# Altium schematic sheet Schematic.SchDoc
size A; SheetNumber: 1; SheetTotal: 1
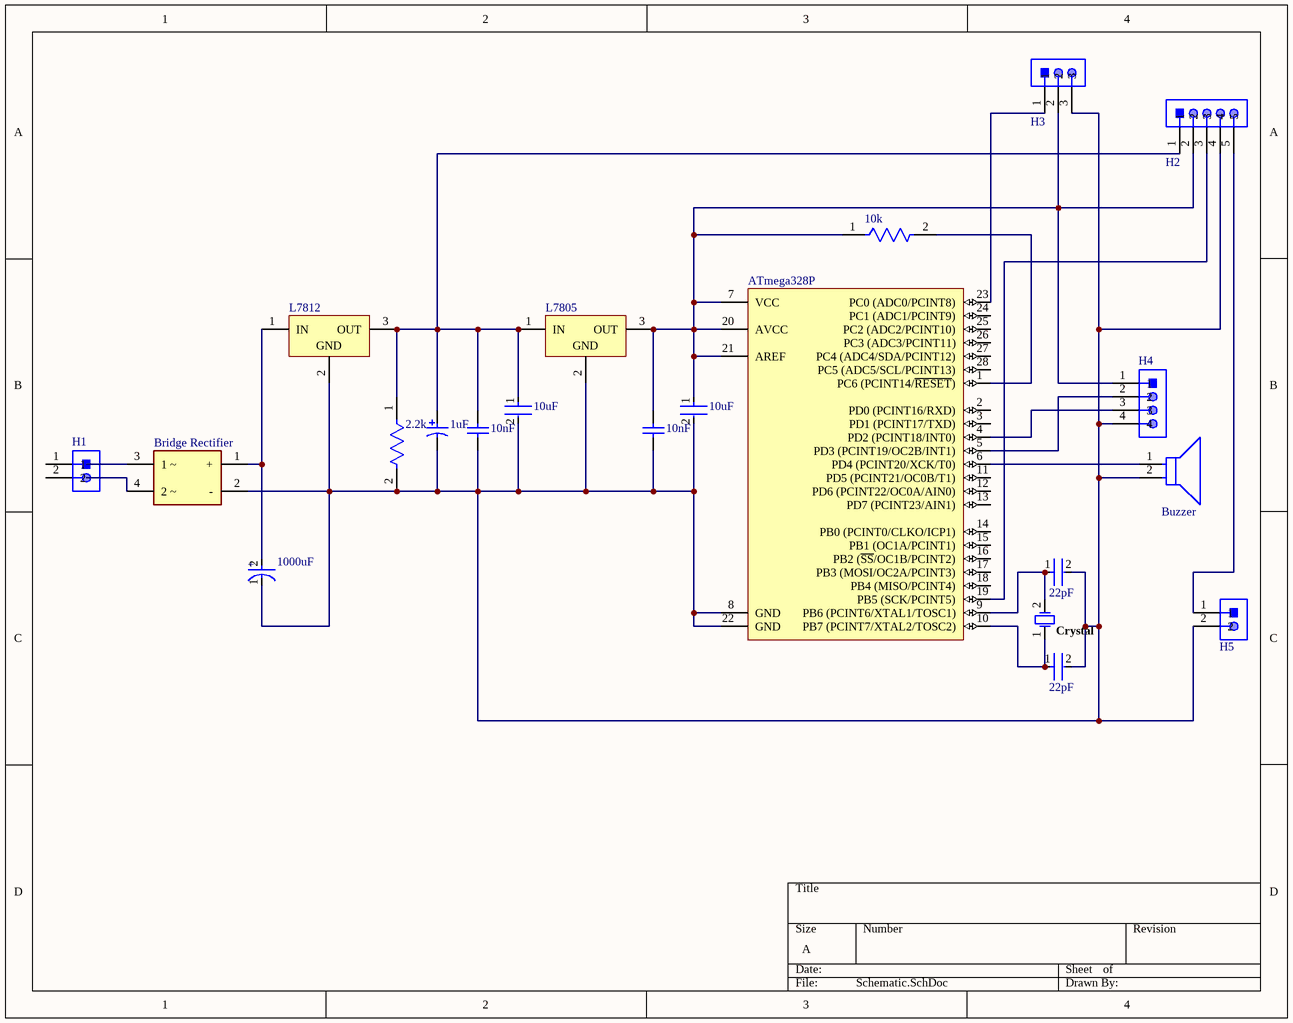
[diagram p0: Schematic.SchDoc]

## Parts
(Parts that share a designator on the sheet are numbered #1, #2 ... from top to bottom, then left to right.)
1uF  ECA-1HHG010  [CAPPR55-200-1100X500X1200]  (value not drawn)
2.2k  CF18JT2K20  [FP-CF18-MFG]  (value not drawn)
10k  MBB02070C1002FCT00  [FP-MBB0207-MFG]  (value not drawn)
10nF#1  C315C103K1R5TA  [KEMT-C315-THT-2]  (value not drawn)
10nF#2  C315C103K1R5TA  [KEMT-C315-THT-2]  (value not drawn)
10uF#1  RCER71E106K3M1H03A  [FP-RCE3M1-MFG]  (value not drawn)
10uF#2  RCER71E106K3M1H03A  [FP-RCE3M1-MFG]  (value not drawn)
22pF#1  RCE5C2A220J0A2H03B  [FP-RCE0DB-MFG]  (value not drawn)
22pF#2  RCE5C2A220J0A2H03B  [FP-RCE0DB-MFG]  (value not drawn)
1000uF  EEUFM1E102  [FP-RAD-TH-D_12_5_0_5-L_20-MFG]  (value not drawn)
ATmega328P  ATmega328-PU  [28P3]  (value not drawn)
Bridge_Rectifier  DF06S-E3/77  [FP-DF06S-E3-77-0]  (value not drawn)
Buzzer  PKM22EPPH4002-B0  [FP-PKM22EPPH4002-B0-MFG]  (value not drawn)
Crystal  FOXSLF/160-20  [FOX-FOXSLF160-20]  (value not drawn)
H1  61300211121  [61300211121]  (value not drawn)
H2  61300511121  [61300511121]  (value not drawn)
H3  61300311121  [61300311121]  (value not drawn)
H4  61300411121  [61300411121]  (value not drawn)
H5  61300211121  [61300211121]  (value not drawn)
L7805  L7805CV  [TO220]  (value not drawn)
L7812  L7812CV  [TO220]  (value not drawn)

## Nets
Net1uF_1: 1uF.1 2.2k.1 10nF#1.2 10uF#1.1 H2.1 L7805.1(IN) L7812.3(OUT)
Net1uF_2: 1uF.2 2.2k.2 10nF#1.1 10nF#2.1 10uF#1.2 10uF#2.2 22pF#1.2 22pF#2.2 1000uF.1(C) ATmega328P.8(GND) ATmega328P.22(GND) Bridge_Rectifier.2(-) Buzzer.2 H2.4 H3.3 H4.4 H5.2 L7805.2(GND) L7812.2(GND)
Net10k_1: 10k.1 10nF#2.2 10uF#2.1 ATmega328P.7(VCC) ATmega328P.20(AVCC) ATmega328P.21(AREF) H2.2 H3.2 H4.1 L7805.3(OUT)
Net10k_2: 10k.2 ATmega328P.1(PC6_(PCINT14/~{RESET}))
Net22pF#1_1: 22pF#1.1 ATmega328P.9(PB6_(PCINT6/XTAL1/TOSC1)) Crystal.2
Net22pF#2_1: 22pF#2.1 ATmega328P.10(PB7_(PCINT7/XTAL2/TOSC2)) Crystal.1
Net1000uF_2: 1000uF.2(A) Bridge_Rectifier.1(+) L7812.1(IN)
NetATmega328P_4: ATmega328P.4(PD2_(PCINT18/INT0)) H4.3
NetATmega328P_5: ATmega328P.5(PD3_(PCINT19/OC2B/INT1)) H4.2
NetATmega328P_6: ATmega328P.6(PD4_(PCINT20/XCK/T0)) Buzzer.1
NetATmega328P_19: ATmega328P.19(PB5_(SCK/PCINT5)) H2.3
NetATmega328P_23: ATmega328P.23(PC0_(ADC0/PCINT8)) H3.1
NetH2_5: H2.5 H5.1

Not connected (* = marked no-connect by the designer): ATmega328P 2(PD0_(PCINT16/RXD)) 3(PD1_(PCINT17/TXD)) 11(PD5_(PCINT21/OC0B/T1)) 12(PD6_(PCINT22/OC0A/AIN0)) 13(PD7_(PCINT23/AIN1)) 14(PB0_(PCINT0/CLKO/ICP1)) 15(PB1_(OC1A/PCINT1)) 16(PB2_(~{SS}/OC1B/PCINT2)) 17(PB3_(MOSI/OC2A/PCINT3)) 18(PB4_(MISO/PCINT4)) 24(PC1_(ADC1/PCINT9)) 25(PC2_(ADC2/PCINT10)) 26(PC3_(ADC3/PCINT11)) 27(PC4_(ADC4/SDA/PCINT12)) 28(PC5_(ADC5/SCL/PCINT13)); Bridge_Rectifier 3(1_~) 4(2_~); H1 1 2

## Notes on the sheet
- (in symbol CMP-05427-000606-1) +

## Library data of the parts
1uF = CMP-1665-00039-1: Aluminum Electrolytic Capacitor, 1 uF, +/- 20%, 50 V, -55 to 105 degC, 2-Pin THD, RoHS, Bulk; Channels: 2; ComponentLink1Description: Manufacturer URL; ComponentLink2Description: Datasheet; ComponentLink2URL: https://datasheet.ciiva.com/7275/94060-7275472.pdf; PackageDescription: 2-Pin Radial Lead, Dia 5 mm, Body Length 11 mm; PackageReference: CAPPR55-200-1100X500X1200; Mount: Through Hole; Radiation Hardening: No; ComponentLink1URL: http://www.panasonic.com/; Min Operating Temperature: -30 degC; Package Quantity: 150; Max Operating Temperature: 70 degC; DatasheetVersion: Mar-05; RoHSCompliant: true; Packaging: Bulk
2.2k = CMP-26528-000001-1: RES 2.2K OHM 1/8W 5% CF AXIAL; Manufacturer: Stackpole Electronics Inc; Description: RES 2.2K OHM 1/8W 5% AXIAL; Value: 2.2kΩ; Voltage Rating: 250V; Temperature Coefficient: 0/-400ppm/°C; Power Rating: 0.125W; Composition: Carbon Film; Octopart: https://octopart.com/cf18jt2k20-stackpole+electronics-19205714; Tolerance: 5%; Series: CF; Temperature Range Low: -55°C; ComponentLink2URL: https://www.seielect.com/catalog/sei-cf_cfm.pdf; Ipc Land Pattern Name: RESAD656W65L360D200; Package: CF18; Device Class L2: Resistors; Device Class L3: Through-Hole Resistors; Resistance: 2.2kΩ; Height: 2mm; Category: Res; ComponentLink2Description: Datasheet; Manufacturer Part Number: CF18JT2K20; Lead Free: Yes; Temperature Range High: +155°C; Temperature: -55°C to +155°C; RoHS: TRUE; Device Class L1: Passive Components; Digikey Description: RES 2.2K OHM 1/8W 5% CF AXIAL; Automotive: No
10k = CMP-02408-000035-1: RES 10K OHM 0.6W 1% AXIAL; Voltage Rating: 300V; Resistance: 10kR; Max Power Dissipation: 600mW; Temperature Coefficient: 50ppm/°C; Radiation Hardening: No; Case/Package: Conformal; Termination: Axial; Military Standard: Not; Length: 6.5mm; Voltage Rating (DC): 300V; RoHS Compliant: Yes; Number of Terminations: 2; Packaging: Tape and Reel; Features: Automotive AEC-Q200; Tolerance: 1%; Min Operating Temperature: -55°C; Power Rating: 600mW; Lead Free: Lead Free; Resistor Type: Metal Film; Construction: Cylindrical; Series: MBB 0207 - Professional; Max Operating Temperature: 155°C; Diameter: 2.5mm; Resistance Tolerance: 1%; Contact Plating: Tin; Technology: THIN FILM
10nF#1 10nF#2 = CMP-1664-00007-1: Capacitor, Ceramic, 0.01 uF, +/- 10%, 100 V, X7R, -55 to 125 degC, 2-Pin THD, RoHS, Bulk; Output Voltage: 70 V; Case\Package: PDIP; Forward Current: 60 mA; Nominal Vf: 1.3 V; Forward Voltage: 1.5 V; Channels: 2; Max Power Dissipation: 400 mW; Vce Max: 500 mV; ComponentLink1Description: Manufacturer URL; ComponentLink2Description: Datasheet; Packaging: Rail/Tube; RoHSCompliant: true; Package Quantity: 2000; PackageReference: C315-THT-2; Min Operating Temperature: -55 degC; Max Operating Temperature: 100 degC; Radiation Hardening: No; ComponentLink1URL: http://www.kemet.com/; DatasheetVersion: Aug-16; Pins: 16; PackageDescription: 2-Pin Through Hole Device, Body 3.81 x 2.54 mm; REACH SVHC: Unknown; Mount: Through Hole; ComponentLink2URL: http://capacitoredge.kemet.com/capedge2/DataSheet/Datasheet-C315C103K1R5TA.pdf?pn=C315C103K1R5TA{BULK}
10uF#1 10uF#2 = CMP-06035-005744-1: Cap Ceramic 10uF 25V X7R ±10% Radial 5mm +125°C Automotive Ammo Pack; Lead/Base Style: Formed Leads; Lead Diameter: 0.5mm; Length: 0.217inch; Package Quantity: 1500; Width: 0.157inch; Resistor Type: Ceramic; Height - Seated (Max): 0.197inch; Ratings: AEC-Q200; Lead Pitch: 0.197inch; Packaging: Tape and Reel; Tolerance: 10%; Voltage Rating (DC): 25V; Capacitance: 10uF; Termination: Radial; Mount: Through Hole; Voltage Rating: 25V; Min Operating Temperature: -55°C; Height: 5mm; Dielectric: X7R; Max Operating Temperature: 125°C; Case/Package: Radial
22pF#1 22pF#2 = CMP-06035-026305-1: Cap Ceramic 22pF 100V C0G ±5% Radial 2.5mm +125°C Bulk; Lead/Base Style: Straight; Lead Diameter: 0.5mm; Termination: Radial; Voltage Rating: 100V; Voltage: 100V; Diameter: 3.6mm; Mount: Through Hole; Height - Seated (Max): 0.138inch; Ratings: AEC-Q200; Resistor Type: Ceramic; Dielectric: C0G; Lead Free: Lead Free; Height: 3.5mm; Voltage Rating (DC): 100V; Capacitance: 22pF; Lead Pitch: 0.098inch; Length: 3.6mm; Width: 2.5mm; Min Operating Temperature: -55°C; Case/Package: Radial; Tolerance: 5%; Max Operating Temperature: 125°C; Packaging: Bulk; Depth: 3.5mm; Package Quantity: 500
1000uF = CMP-05427-000606-1: Aluminum Electrolytic Capacitors (Radial Lead Type) 1000uF ±20% 25V; Lead Length: 17mm; ESR (Equivalent Series Resistance): 18mR; Dissipation Factor: 0.14%; Lead Diameter: 0.6mm; Dielectric Material: Aluminium; Capacitance: 1mF; Life (Hours): 5000Hour; Ripple Current: 2.6A; Contact Plating: Tin; Voltage: 25V; Length: 20mm; Packaging: Bulk; RoHS Compliant: Yes; REACH SVHC: Yes; Lead Free: Lead Free; Tolerance: 20%; Features: General Purpose; Construction: RADIAL; Lead Pitch: 5mm; Impedance: 18mR; Min Operating Temperature: -40°C; Case/Package: Radial; Diameter: 12.5mm; Height - Seated (Max): 0.787inch; Package Quantity: 200; Mount: Through Hole; Max Operating Temperature: 105°C; Series: FM; Height: 20mm; Voltage Rating (DC): 25V; Termination: Radial; Voltage Rating: 25V; Radiation Hardening: No
ATmega328P = CMP-0095-00015-2: 8-bit AVR Microcontroller, 32KB Flash, 1KB EEPROM, 2KB SRAM, 28-pin PDIP, Industrial Grade (-40°C to 85°C); ComponentLink3Description: ATmega48A/48PA/88A/88PA/168A/168PA/328/328P Summary; RevisionNote: DatasheetVersion updated. URLs added.; DatasheetVersion: revD, May-2011; ComponentLink1URL: http://www.atmel.com/; PackageVersion: revB, Sep-2001; PackageDescription: 28-lead (0.300"/7.62mm Wide) Plastic Dual Inline Package (PDIP); PackageReference: 28P3; ComponentLink1Description: Manufacturer URL; ComponentLink2Description: ATmega48A/48PA/88A/88PA/168A/168PA/328/328P Datasheet; ComponentLink3URL: http://www.atmel.com/dyn/resources/prod_documents/8271S.pdf; ComponentLink2URL: http://www.atmel.com/dyn/resources/prod_documents/8271.pdf
Bridge_Rectifier = CMP-02540-000041-1: BRIDGE RECT 1PHASE 600V 1A DFS; Manufacturer: Vishay; Max Junction Temp: +150°C; Value: 25pF; Peak Reverse Current: 5uA; Standoff Height: 0.076mm; Description: Bridge Rectifier Single Phase Standard 600V Surface Mount DFS; Max Surge Forward Current: 50A; ComponentLink2Description: Datasheet; Height: 3.63mm; Forward Current: 1A; Package: 0; Temperature Range High: +150°C; Max Repetitive Reverse Voltage: 600V; Device Class L1: Discrete Semiconductors; Capacitance: 25pF; Device Class L3: Rectifier Diodes; RoHS: TRUE; Category: Diode; Temperature: -55°C to +150°C; Mouser Description: Bridge Rectifiers 1.0 Amp 600 Volt; Automotive: No; Manufacturer Part Number: DF06S-E3/77; Device Class L2: Diodes; Octopart: https://octopart.com/df06s-e3%2F77-vishay-42173534; Digikey Description: BRIDGE RECT 1PHASE 600V 1A DFS; Lead Free: Yes; ComponentLink2URL: http://www.vishay.com/docs/88573/dfs.pdf; Temperature Range Low: -55°C
Buzzer = CMP-06202-000034-2: AUDIO PIEZO TRANSDUCER 30V TH; Voltage Rating (DC): 25V; Self Resonant Frequency: 4kHz; Washable: No; Nominal Input Voltage: 3V; Mount: Through Hole; Max Frequency: 4kHz; Termination: Solder; Radiation Hardening: No; REACH SVHC: No SVHC; Series: PK; Max Operating Temperature: 70°C; Packaging: Bulk; Diameter: 22mm; Frequency: 4kHz; Package Quantity: 900; Height: 7mm; Max Supply Voltage: 30V; Lead Free: Lead Free; Min Operating Temperature: -20°C
Crystal = CMP-1749-00003-1: Resistance Weld Thru-Hole Crystal, 16 MHz, -20 to 70 degC, 2-Pin THD, RoHS, Bulk; Voltage Rating: 250 V; Tolerance: 1%; Resistance: 221 kohm; Case\Package: Axial; Power Rating: 250 mW; RoHSCompliant: true; Package Quantity: 200; Packaging: Bulk; Min Operating Temperature: -55 degC; DatasheetVersion: Mar-15; ComponentLink1URL: http://www.foxonline.com/; Max Operating Temperature: 155 degC; PackageReference: FOXSLF160-20; Mount: Through Hole; PackageDescription: 2-Pin Through Hole Device, Body 11.35 x 4.65 mm; ComponentLink1Description: Manufacturer URL; ComponentLink2URL: http://www.foxonline.com/pdfs/hc49slf.pdf; ComponentLink2Description: Datasheet; Length: 0.248 inch
H1 H5 = CMP-1712-00002-4: THT Vertical Pin Header WR-PHD, Pitch 2.54 mm, Single Row, 2 pins; Manufacturer: Wurth Elektronik; Rated Current: 3A; Gender: Male; Withstanding Voltage: 500VAC; Working Voltage: 250VAC; Pitch: 2.54mm; Contact Resistance: 20mOhm; Pin Number: 2; Mounting Technology: THT; Orientation: Vertical; Operating Temperature: -40to105degC; Packaging: Bag; Publisher: WurthElektronik; Datasheet URL: https://katalog.we-online.de/em/datasheet/6130xx11121.pdf; Manufacturer URL: http://www.we-online.de; Row Number: Single; Package Reference: 61300211121; Part Number: 61300211121
H2 = CMP-1502-01068-1: THT Vertical Pin Header WR-PHD, Pitch 2.54 mm, Single Row, 5 pins; Manufacturer: Wurth Elektronik; Pin Number: 5; Contact Resistance: 20mOhm; Working Voltage: 250VAC; Pitch: 2.54mm; Withstanding Voltage: 500VAC; Rated Current: 3A; Gender: Male; Datasheet URL: https://katalog.we-online.de/em/datasheet/6130xx11121.pdf; Orientation: Vertical; Mounting Technology: THT; Row Number: Single; Package Reference: 61300511121; Publisher: WurthElektronik; Part Number: 61300511121; Packaging: Bag; Manufacturer URL: http://www.we-online.de; Operating Temperature: -40to105degC
H3 = CMP-1502-01062-1: THT Vertical Pin Header WR-PHD, Pitch 2.54 mm, Single Row, 3 pins; Manufacturer: Wurth Elektronik; Withstanding Voltage: 500VAC; Working Voltage: 250VAC; Rated Current: 3A; Pitch: 2.54mm; Pin Number: 3; Gender: Male; Contact Resistance: 20mOhm; Package Reference: 61300311121; Manufacturer URL: http://www.we-online.de; Datasheet URL: https://katalog.we-online.de/em/datasheet/6130xx11121.pdf; Operating Temperature: -40to105degC; Part Number: 61300311121; Orientation: Vertical; Packaging: Bag; Row Number: Single; Mounting Technology: THT; Publisher: WurthElektronik
H4 = CMP-1502-01064-1: THT Vertical Pin Header WR-PHD, Pitch 2.54 mm, Single Row, 4 pins; Manufacturer: Wurth Elektronik; Withstanding Voltage: 500VAC; Rated Current: 3A; Working Voltage: 250VAC; Pin Number: 4; Gender: Male; Contact Resistance: 20mOhm; Pitch: 2.54mm; Manufacturer URL: http://www.we-online.de; Operating Temperature: -40to105degC; Packaging: Bag; Mounting Technology: THT; Package Reference: 61300411121; Datasheet URL: https://katalog.we-online.de/em/datasheet/6130xx11121.pdf; Publisher: WurthElektronik; Part Number: 61300411121; Row Number: Single; Orientation: Vertical
L7805 = CMP-0244-00483-1: Positive Voltage Regulator, 5V, 3-Pin TO-220; PackageDescription: TO, Thru-Hole, Vertical, Heatsink Mounted; 3 In-Line Leads; Pitch 2.54 mm; ComponentLink2Description: Datasheet; PackageReference: TO220; ComponentLink3URL: http://www.st.com/internet/com/TECHNICAL_RESOURCES/TECHNICAL_LITERATURE/PACKAGE_INFORMATION/CD00004649.pdf; DatasheetVersion: 16/11/2011; ComponentLink1Description: Manufacturer URL; ComponentLink1URL: http://www.st.com; PackageVersion: ver3.0; ComponentLink3Description: Package Specification; ComponentLink2URL: http://www.st.com/internet/com/TECHNICAL_RESOURCES/TECHNICAL_LITERATURE/DATASHEET/CD00000444.pdf
L7812 = CMP-0244-00450-1: Positive Voltage Regulator, 12V, 3-Pin TO-220; PackageDescription: TO, Thru-Hole, Vertical, Heatsink Mounted; 3 In-Line Leads; Pitch 2.54 mm; ComponentLink3URL: http://www.st.com/internet/com/TECHNICAL_RESOURCES/TECHNICAL_LITERATURE/PACKAGE_INFORMATION/CD00004649.pdf; ComponentLink1URL: http://www.st.com; ComponentLink2Description: Datasheet; ComponentLink3Description: Package Specification; ComponentLink2URL: http://www.st.com/internet/com/TECHNICAL_RESOURCES/TECHNICAL_LITERATURE/DATASHEET/CD00000444.pdf; DatasheetVersion: 16/11/2011; PackageVersion: ver3.0; PackageReference: TO220; ComponentLink1Description: Manufacturer URL